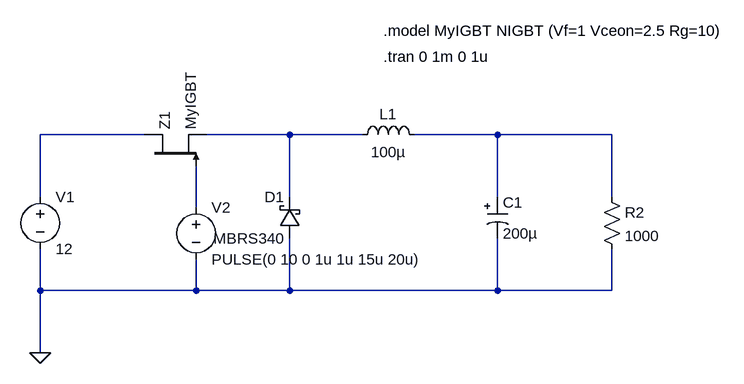
[diagram p0: schematic BuckConverter.asc]
BuckConverter.asc, the LTspice schematic file:
Version 4
SHEET 1 1060 680
WIRE 176 160 16 160
WIRE 400 160 272 160
WIRE 512 160 400 160
WIRE 720 160 592 160
WIRE 896 160 720 160
WIRE 16 256 16 160
WIRE 400 256 400 160
WIRE 720 256 720 160
WIRE 896 256 896 160
WIRE 256 272 256 208
WIRE 16 400 16 336
WIRE 256 400 256 352
WIRE 256 400 16 400
WIRE 400 400 400 320
WIRE 400 400 256 400
WIRE 720 400 720 320
WIRE 720 400 400 400
WIRE 896 400 896 336
WIRE 896 400 720 400
WIRE 16 496 16 400
FLAG 16 496 0
SYMBOL Misc/NIGBT 176 208 R270
SYMATTR InstName Z1
SYMATTR Value MyIGBT
SYMBOL voltage 16 240 R0
SYMATTR InstName V1
SYMATTR Value 12
SYMBOL ind 496 176 R270
WINDOW 0 32 56 VTop 2
WINDOW 3 5 56 VBottom 2
SYMATTR InstName L1
SYMATTR Value 100µ
SYMATTR SpiceLine Ipk=900m Rser=320m Rpar=86.02K Cpar=2.748p mfg="   ---" pn="   ---"
SYMBOL schottky 416 320 R180
WINDOW 0 24 64 Left 2
WINDOW 3 24 0 Left 2
SYMATTR InstName D1
SYMATTR Value MBRS340
SYMATTR Description Diode
SYMATTR Type diode
SYMBOL polcap 704 256 R0
WINDOW 3 24 56 Left 2
SYMATTR InstName C1
SYMATTR Value 200µ
SYMATTR Description Capacitor
SYMATTR Type cap
SYMATTR SpiceLine V=X Rser=900m Lser=0 mfg="   ---" pn="   ---" type="   ---"
SYMBOL Res 880 240 R0
SYMATTR InstName R2
SYMATTR Value 1000
SYMBOL voltage 256 256 R0
SYMATTR InstName V2
SYMATTR Value PULSE(0 10 0 1u 1u 15u 20u)
TEXT 544 0 Left 2 !.model MyIGBT NIGBT (Vf=1 Vceon=2.5 Rg=10)
TEXT 544 40 Left 2 !.tran 0 1m 0 1u

The netlist it stands for:
* BuckConverter.asc
Z1 N001 N004 N002 MyIGBT
V1 N001 0 12
L1 N002 N003 100µ Ipk=900m Rser=320m Rpar=86.02K Cpar=2.748p mfg="   ---" pn="   ---"
D1 0 N002 MBRS340
C1 N003 0 200µ V=X Rser=900m Lser=0 mfg="   ---" pn="   ---" type="   ---"
R2 N003 0 1000
V2 N004 0 PULSE(0 10 0 1u 1u 15u 20u)
.model D D
.lib standard.dio
.model MyIGBT NIGBT (Vf=1 Vceon=2.5 Rg=10)
.tran 0 1m 0 1u
.backanno
.end